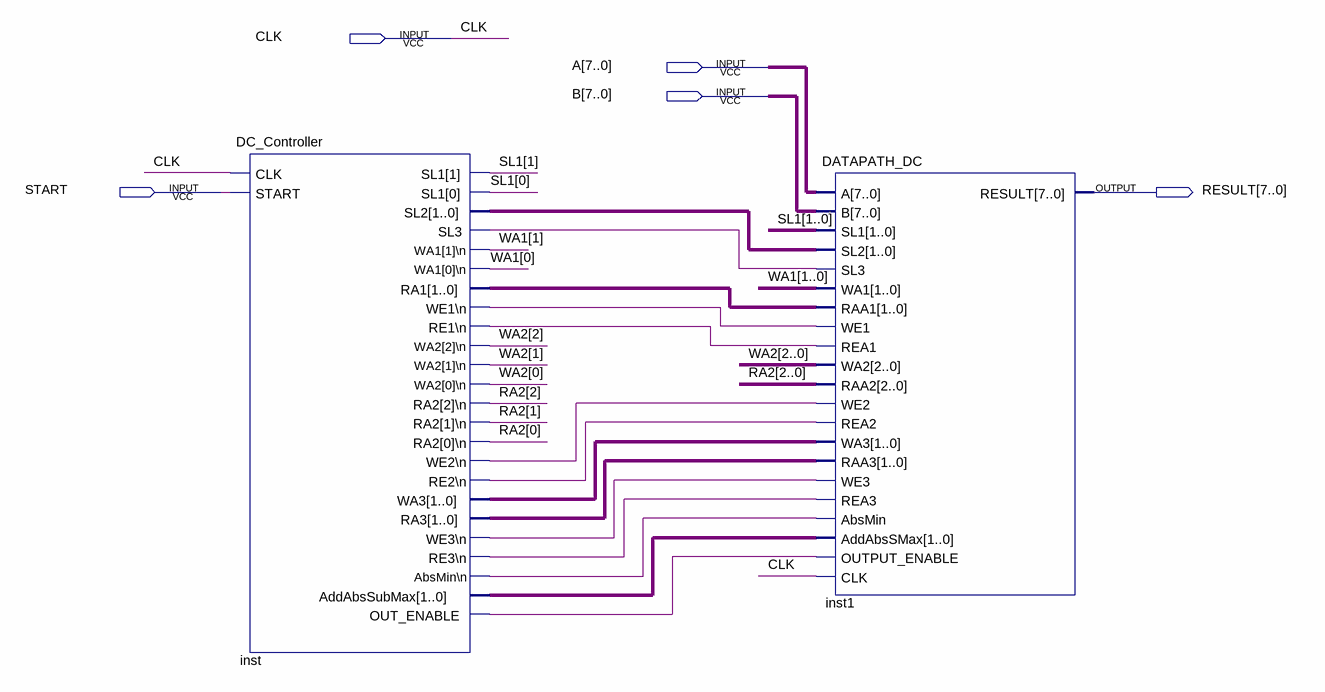
[diagram p0: schematic sheet]
// Quartus schematic DC_FINAL.bdf as structural Verilog: 2 symbols, 5 pins
module DC_FINAL (
  input  CLK,
  input  [7:0] A,
  input  [7:0] B,
  input  START,
  output [7:0] RESULT
);

  wire inst_absmin_n, inst_out_enable, inst_re1_n, inst_re2_n, inst_re3_n, inst_sl3, inst_we1_n, inst_we2_n,
       inst_we3_n;
  wire [1:0] inst_addabssubmax, inst_ra1, inst_ra3, inst_sl2, inst_wa3, SL1, WA1;
  wire [2:0] RA2, WA2;

  DC_Controller inst (
    .CLK(CLK), .START(START), .SL1(SL1), .SL2(inst_sl2), .SL3(inst_sl3), .\WA1[1]\n (WA1[1]),
    .\WA1[0]\n (WA1[0]), .RA1(inst_ra1), .\WE1\n (inst_we1_n), .\RE1\n (inst_re1_n), .\WA2[2]\n (WA2[2]),
    .\WA2[1]\n (WA2[1]), .\WA2[0]\n (WA2[0]), .\RA2[2]\n (RA2[2]), .\RA2[1]\n (RA2[1]), .\RA2[0]\n (RA2[0]),
    .\WE2\n (inst_we2_n), .\RE2\n (inst_re2_n), .WA3(inst_wa3), .RA3(inst_ra3), .\WE3\n (inst_we3_n),
    .\RE3\n (inst_re3_n), .\AbsMin\n (inst_absmin_n), .AddAbsSubMax(inst_addabssubmax),
    .OUT_ENABLE(inst_out_enable));
  DATAPATH_DC inst1 (
    .A(A), .B(B), .SL1(SL1), .SL2(inst_sl2), .SL3(inst_sl3), .WA1(WA1), .RAA1(inst_ra1), .WE1(inst_we1_n),
    .REA1(inst_re1_n), .WA2(WA2), .RAA2(RA2), .WE2(inst_we2_n), .REA2(inst_re2_n), .WA3(inst_wa3),
    .RAA3(inst_ra3), .WE3(inst_we3_n), .REA3(inst_re3_n), .AbsMin(inst_absmin_n),
    .AddAbsSMax(inst_addabssubmax), .OUTPUT_ENABLE(inst_out_enable), .CLK(CLK), .RESULT(RESULT));
endmodule
